# EAGLE schematic biggity (EAGLE 9.1.1)
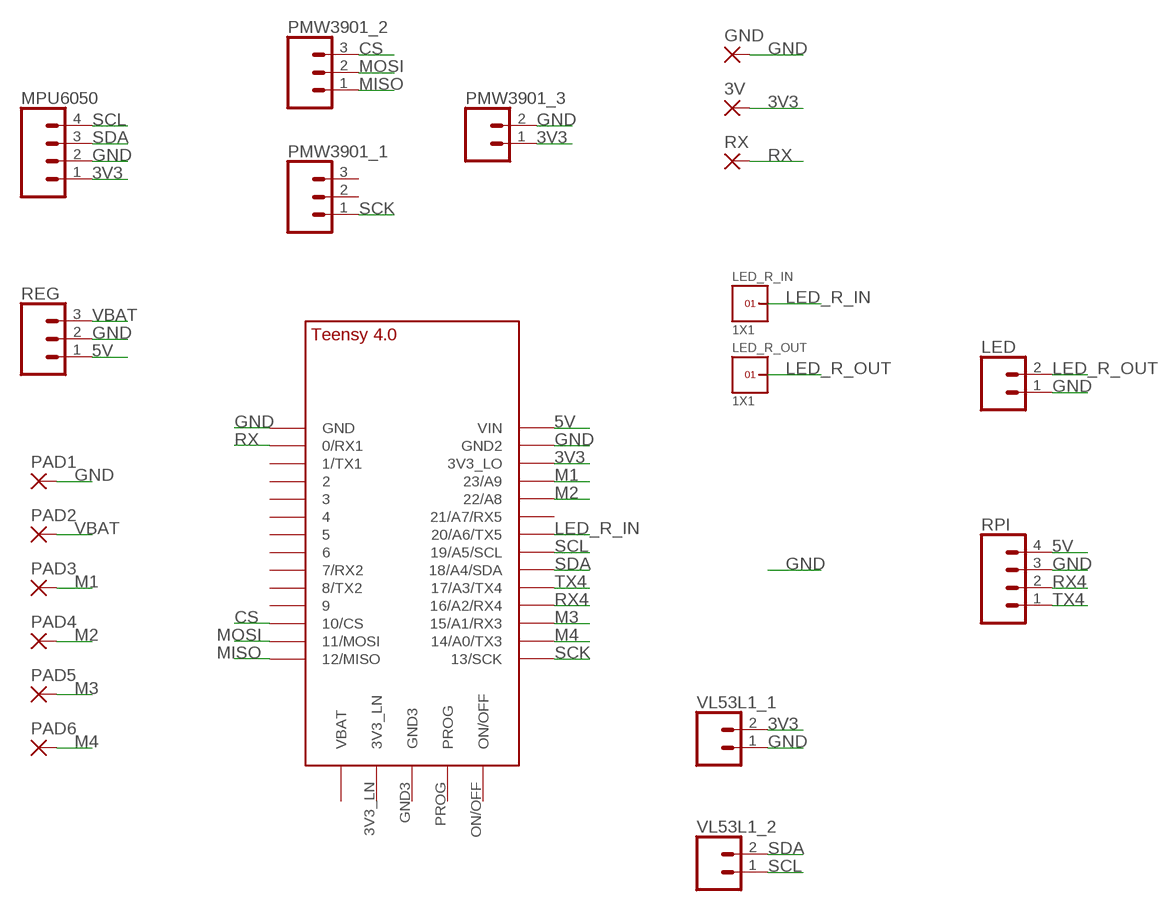
[diagram p0: schematic, sheet 1]

## Parts
3V  SMD2  [SMD1,27-2,54]
GND  SMD2  [SMD1,27-2,54]
LED  CONN_021X02_NO_SILK  [1X02_NO_SILK]
LED_R_IN  1X1  [1X1]
LED_R_OUT  1X1  [1X1]
MPU6050  CONN_041X04_NO_SILK  [1X04_NO_SILK]
PAD1  SMD2  [SMD1,27-2,54]
PAD2  SMD2  [SMD1,27-2,54]
PAD3  SMD2  [SMD1,27-2,54]
PAD4  SMD2  [SMD1,27-2,54]
PAD5  SMD2  [SMD1,27-2,54]
PAD6  SMD2  [SMD1,27-2,54]
PMW3901_1  CONN_031X03_NO_SILK  [1X03_NO_SILK]
PMW3901_2  CONN_031X03_NO_SILK  [1X03_NO_SILK]
PMW3901_3  CONN_021X02_NO_SILK  [1X02_NO_SILK]
REG  CONN_031X03_NO_SILK  [1X03_NO_SILK]
RPI  CONN_041X04_NO_SILK  [1X04_NO_SILK]
RX  SMD2  [SMD1,27-2,54]
U$1  TEENSY_4.0  [TEENSY_4.0]
VL53L1_1  CONN_021X02_NO_SILK  [1X02_NO_SILK]
VL53L1_2  CONN_021X02_NO_SILK  [1X02_NO_SILK]

## Nets
3V3: 3V.1(P) MPU6050.1 PMW3901_3.1 U$1.3V3_LO VL53L1_1.2
5V: REG.1 RPI.4 U$1.VIN
CS: PMW3901_2.3 U$1.10/CS
GND: GND.1(P) LED.1 MPU6050.2 PAD1.1(P) PMW3901_3.2 REG.2 RPI.3 U$1.GND U$1.GND2 VL53L1_1.1
LED_R_IN: LED_R_IN.1 U$1.20/A6(20/A6/TX5)
LED_R_OUT: LED.2 LED_R_OUT.1
M1: PAD3.1(P) U$1.23/A9
M2: PAD4.1(P) U$1.22/A8
M3: PAD5.1(P) U$1.15/A1(15/A1/RX3)
M4: PAD6.1(P) U$1.14/A0(14/A0/TX3)
MISO: PMW3901_2.1 U$1.12/MISO
MOSI: PMW3901_2.2 U$1.11/MOSI
RX: RX.1(P) U$1.0/RX(0/RX1)
RX4: RPI.2 U$1.16/A2(16/A2/RX4)
SCK: PMW3901_1.1 U$1.13/SCK
SCL: MPU6050.4 U$1.19/A5/SCL VL53L1_2.1
SDA: MPU6050.3 U$1.18/A4/SDA VL53L1_2.2
TX4: RPI.1 U$1.17/A3(17/A3/TX4)
VBAT: PAD2.1(P) REG.3
Unconnected: PMW3901_1.2 PMW3901_1.3 U$1.1/TX(1/TX1) U$1.2 U$1.3/CANTX U$1.3V3_LN U$1.4/CANRX U$1.5 U$1.6 U$1.7(7/RX2) U$1.8(8/TX2) U$1.9/CS U$1.21/A7(21/A7/RX5) U$1.GND3 U$1.ON/OFF U$1.PROG U$1.VBAT\(VBAT)

## Library data of the parts
3V GND PAD1-PAD6 RX = wirepad:SMD2: SMD PAD
LED PMW3901_3 VL53L1_1 VL53L1_2 = SparkFun-Connectors:CONN_02: Multi connection point. Often used as Generic Header-pin footprint for 0.1 inch spaced/style header connections On any of the 0.1 inch spaced packages, you can populate with these: Break Away Headers - Straight <https://www.sparkfun.com/products/116> (PRT-00116) Break Away Male Headers - Right Angle <https://www.sparkfun.com/products/553> (PRT-00553) Female Headers <https://www.sparkfun.com/products/115> (PRT-00115) Break Away Headers - Machine Pin <https://www.sparkfun.com/products/117> (PRT-00117) Break Away Female Headers - Swiss Machine Pin <https://www.sparkfun.com/products/743> (PRT-00743) For SCREWTERMINALS and SPRING TERMINALS visit here: Screw Terimnals on SparkFun.com <https://www.sparkfun.com/search/results?term=Screw+Terminals> (5mm/3.5mm/2.54mm spacing) This device is also useful as a general connection point to wire up your design to another part of your project. Our various solder wires solder well into these plated through hole pads. Hook-Up Wire - Assortment (Stranded, 22 AWG) <https://www.sparkfun.com/products/11375> (PRT-11375) Hook-Up Wire - Assortment (Solid Core, 22 AWG) <https://www.sparkfun.com/products/11367> (PRT-11367) View the entire wire category on our website here <https://www.sparkfun.com/categories/141> Special notes: Molex polarized connector foot print use with: PRT-08233 with associated crimp pins and housings. 2.54_SCREWTERM for use with PRT-10571. 3.5mm Screw Terminal footprints for PRT-08084 5mm Screw Terminal footprints for use with PRT-08432
LED_R_IN LED_R_OUT = headers(2mm):1X1
MPU6050 RPI = SparkFun-Connectors:CONN_04: Multi connection point. Often used as Generic Header-pin footprint for 0.1 inch spaced/style header connections On any of the 0.1 inch spaced packages, you can populate with these: Break Away Headers - Straight <https://www.sparkfun.com/products/116> (PRT-00116) Break Away Male Headers - Right Angle <https://www.sparkfun.com/products/553> (PRT-00553) Female Headers <https://www.sparkfun.com/products/115> (PRT-00115) Break Away Headers - Machine Pin <https://www.sparkfun.com/products/117> (PRT-00117) Break Away Female Headers - Swiss Machine Pin <https://www.sparkfun.com/products/743> (PRT-00743) For SCREWTERMINALS and SPRING TERMINALS visit here: Screw Terimnals on SparkFun.com <https://www.sparkfun.com/search/results?term=Screw+Terminals> (5mm/3.5mm/2.54mm spacing) This device is also useful as a general connection point to wire up your design to another part of your project. Our various solder wires solder well into these plated through hole pads. Hook-Up Wire - Assortment (Stranded, 22 AWG) <https://www.sparkfun.com/products/11375> (PRT-11375) Hook-Up Wire - Assortment (Solid Core, 22 AWG) <https://www.sparkfun.com/products/11367> (PRT-11367) View the entire wire category on our website here <https://www.sparkfun.com/categories/141> Special notes: Molex polarized connector foot print use with SKU : PRT-08231 with associated crimp pins and housings. 1MM SMD Version SKU: PRT-10208; PROD_ID: CONN-09696
PMW3901_1 PMW3901_2 REG = SparkFun-Connectors:CONN_03: Multi connection point. Often used as Generic Header-pin footprint for 0.1 inch spaced/style header connections On any of the 0.1 inch spaced packages, you can populate with these: Break Away Headers - Straight <https://www.sparkfun.com/products/116> (PRT-00116) Break Away Male Headers - Right Angle <https://www.sparkfun.com/products/553> (PRT-00553) Female Headers <https://www.sparkfun.com/products/115> (PRT-00115) Break Away Headers - Machine Pin <https://www.sparkfun.com/products/117> (PRT-00117) Break Away Female Headers - Swiss Machine Pin <https://www.sparkfun.com/products/743> (PRT-00743) Stackable Header - 3 Pin (Female, 0.1") <https://www.sparkfun.com/products/13875> (PRT-13875) For SCREWTERMINALS and SPRING TERMINALS visit here: Screw Terimnals on SparkFun.com <https://www.sparkfun.com/search/results?term=Screw+Terminals> (5mm/3.5mm/2.54mm spacing) This device is also useful as a general connection point to wire up your design to another part of your project. Our various solder wires solder well into these plated through hole pads. Hook-Up Wire - Assortment (Stranded, 22 AWG) <https://www.sparkfun.com/products/11375> (PRT-11375) Hook-Up Wire - Assortment (Solid Core, 22 AWG) <https://www.sparkfun.com/products/11367> (PRT-11367) View the entire wire category on our website here <https://www.sparkfun.com/categories/141> Special notes: Molex polarized connector foot print use with SKU : PRT-08232 with associated crimp pins and housings.
U$1 = TEENSY 4.0:TEENSY_4.0